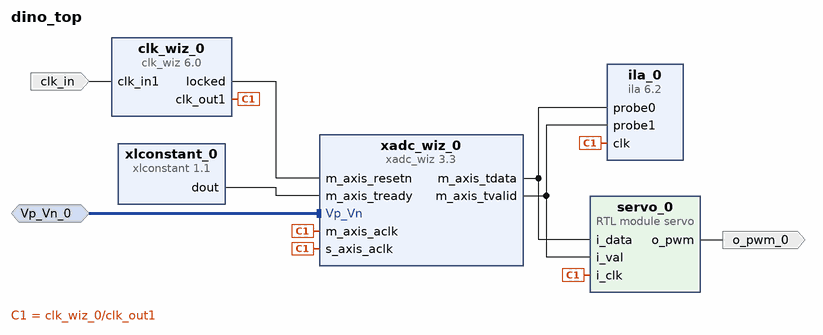
[diagram p0: block diagram of the top level]
# Vivado block design dino_top, xc7a35ticsg324-1L, Vivado 2024.1
create_bd_design dino_top

create_bd_intf_port -mode Slave -vlnv xilinx.com:interface:diff_analog_io_rtl:1.0 Vp_Vn_0
create_bd_port -dir I -type clk clk_in
create_bd_port -dir O o_pwm_0

create_bd_cell -type ip -vlnv xilinx.com:ip:xadc_wiz:3.3 xadc_wiz_0
set_property -dict [list \
  CONFIG.CHANNEL_AVERAGING 256 \
  CONFIG.ENABLE_AXI4STREAM true \
  CONFIG.ENABLE_RESET true \
  CONFIG.INTERFACE_SELECTION None \
  CONFIG.SINGLE_CHANNEL_SELECTION VP_VN \
] [get_bd_cells xadc_wiz_0]
create_bd_cell -type ip -vlnv xilinx.com:ip:clk_wiz:6.0 clk_wiz_0
set_property -dict {CONFIG.USE_LOCKED true CONFIG.USE_RESET false} [get_bd_cells clk_wiz_0]
create_bd_cell -type ip -vlnv xilinx.com:ip:xlconstant:1.1 xlconstant_0
create_bd_cell -type ip -vlnv xilinx.com:ip:ila:6.2 ila_0
set_property -dict [list \
  CONFIG.C_MONITOR_TYPE Native \
  CONFIG.C_NUM_OF_PROBES 2 \
  CONFIG.C_PROBE0_WIDTH 16 \
  CONFIG.C_PROBE1_WIDTH 1 \
] [get_bd_cells ila_0]
create_bd_cell -type module -reference servo servo_0

# ---- connections ----

connect_bd_intf_net -intf_net Vp_Vn_0_1 [get_bd_intf_ports Vp_Vn_0] [get_bd_intf_pins xadc_wiz_0/Vp_Vn]
connect_bd_net -net clk_in1_0_1 [get_bd_ports clk_in] [get_bd_pins clk_wiz_0/clk_in1]
connect_bd_net [get_bd_pins clk_wiz_0/clk_out1] \
  [get_bd_pins xadc_wiz_0/s_axis_aclk] [get_bd_pins xadc_wiz_0/m_axis_aclk] [get_bd_pins ila_0/clk] \
  [get_bd_pins servo_0/i_clk]
connect_bd_net [get_bd_pins clk_wiz_0/locked] [get_bd_pins xadc_wiz_0/m_axis_resetn]
connect_bd_net [get_bd_pins servo_0/o_pwm] [get_bd_ports o_pwm_0]
connect_bd_net [get_bd_pins xadc_wiz_0/m_axis_tdata] [get_bd_pins ila_0/probe0] [get_bd_pins servo_0/i_data]
connect_bd_net [get_bd_pins xadc_wiz_0/m_axis_tvalid] [get_bd_pins ila_0/probe1] [get_bd_pins servo_0/i_val]
connect_bd_net [get_bd_pins xlconstant_0/dout] [get_bd_pins xadc_wiz_0/m_axis_tready]

validate_bd_design
save_bd_design
